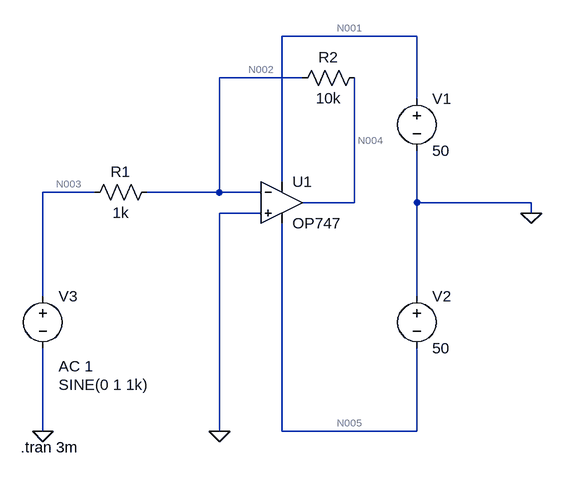
[diagram p0: schematic 2_Zadatak_Lab5.asc]
2_Zadatak_Lab5.asc, the LTspice schematic file:
Version 4
SHEET 1 880 680
WIRE 384 -112 176 -112
WIRE 208 -48 80 -48
WIRE 384 -16 384 -112
WIRE 176 112 176 -112
WIRE -112 128 -192 128
WIRE 80 128 80 -48
WIRE 80 128 -32 128
WIRE 144 128 80 128
WIRE 288 144 288 -48
WIRE 288 144 208 144
WIRE 384 144 384 64
WIRE 560 144 384 144
WIRE 144 160 80 160
WIRE 560 160 560 144
WIRE -192 288 -192 128
WIRE 384 288 384 144
WIRE -192 496 -192 368
WIRE 80 496 80 160
WIRE 176 496 176 176
WIRE 384 496 384 368
WIRE 384 496 176 496
FLAG 560 160 0
FLAG 80 496 0
FLAG -192 496 0
SYMBOL OpAmps\\OP747 176 80 R0
SYMATTR InstName U1
SYMBOL voltage 384 -32 R0
SYMATTR InstName V1
SYMATTR Value 50
SYMBOL voltage 384 272 R0
SYMATTR InstName V2
SYMATTR Value 50
SYMBOL res -16 112 R90
WINDOW 0 0 56 VBottom 2
WINDOW 3 32 56 VTop 2
SYMATTR InstName R1
SYMATTR Value 1k
SYMBOL res 304 -64 R90
WINDOW 0 0 56 VBottom 2
WINDOW 3 32 56 VTop 2
SYMATTR InstName R2
SYMATTR Value 10k
SYMBOL voltage -192 272 R0
WINDOW 3 24 152 Left 2
WINDOW 123 24 124 Left 2
WINDOW 39 0 0 Left 0
SYMATTR InstName V3
SYMATTR Value SINE(0 1 1k)
SYMATTR Value2 AC 1
TEXT -226 520 Left 2 !.tran 3m

The netlist it stands for:
* 2_Zadatak_Lab5.asc
XU1 0 N002 N001 N005 N004 OP747  ; pins In+ In- V+ V- OUT
V1 N001 0 50
V2 0 N005 50
R1 N002 N003 1k
R2 N004 N002 10k
V3 N003 0 SINE(0 1 1k) AC 1
.tran 3m
.backanno
.end

* Results of the author's LTspice run, read from the files saved beside the schematic
* Operating Point, zero values left out:
*   V(n002) = 80 µV
*   V(n005) = -50 V
*   V(n001) = 50 V
*   V(n004) = 811 µV
*   I(R2) = 73.1 nA
*   I(R1) = 80 nA
*   I(V3) = 80 nA
*   I(V2) = -609.8 µA
*   I(V1) = -609.9 µA
*   Ix(u1:1) = -8.901 nA
*   Ix(u1:2) = -6.901 nA
*   Ix(u1:99) = 609.9 µA
*   Ix(u1:50) = -609.8 µA
*   Ix(u1:45) = -73.1 nA
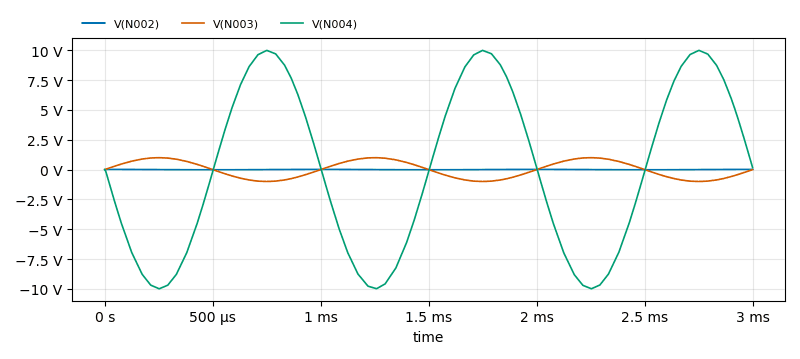
[diagram p1: Transient Analysis of 2_Zadatak_Lab5.asc, plotted from the saved traces]
* Transient Analysis, 1 run:
*   V(N002): min -14.8 mV, max 14.96 mV, average 67.91 µV, rms 10.47 mV, last 14.96 mV
*   V(N003): min -1 V, max 999.9 mV, average -409.1 µV, rms 705.9 mV, last 0 V
*   V(N004): min -9.997 V, max 9.998 V, average 4.769 mV, rms 7.057 V, last 164.5 mV